# Altium schematic sheet WL-FPGA.SchDoc
size 594 x 420 mm; Address1: Address1; Address2: Address2; Address3: Address3; Address4: Address4; DocumentNumber: Wolf-Lite; SheetNumber: 3; Scale: 1:1; DocumentType: Схема электрическая принципиальная; FirstReferrence: UA3REO/R7KBI
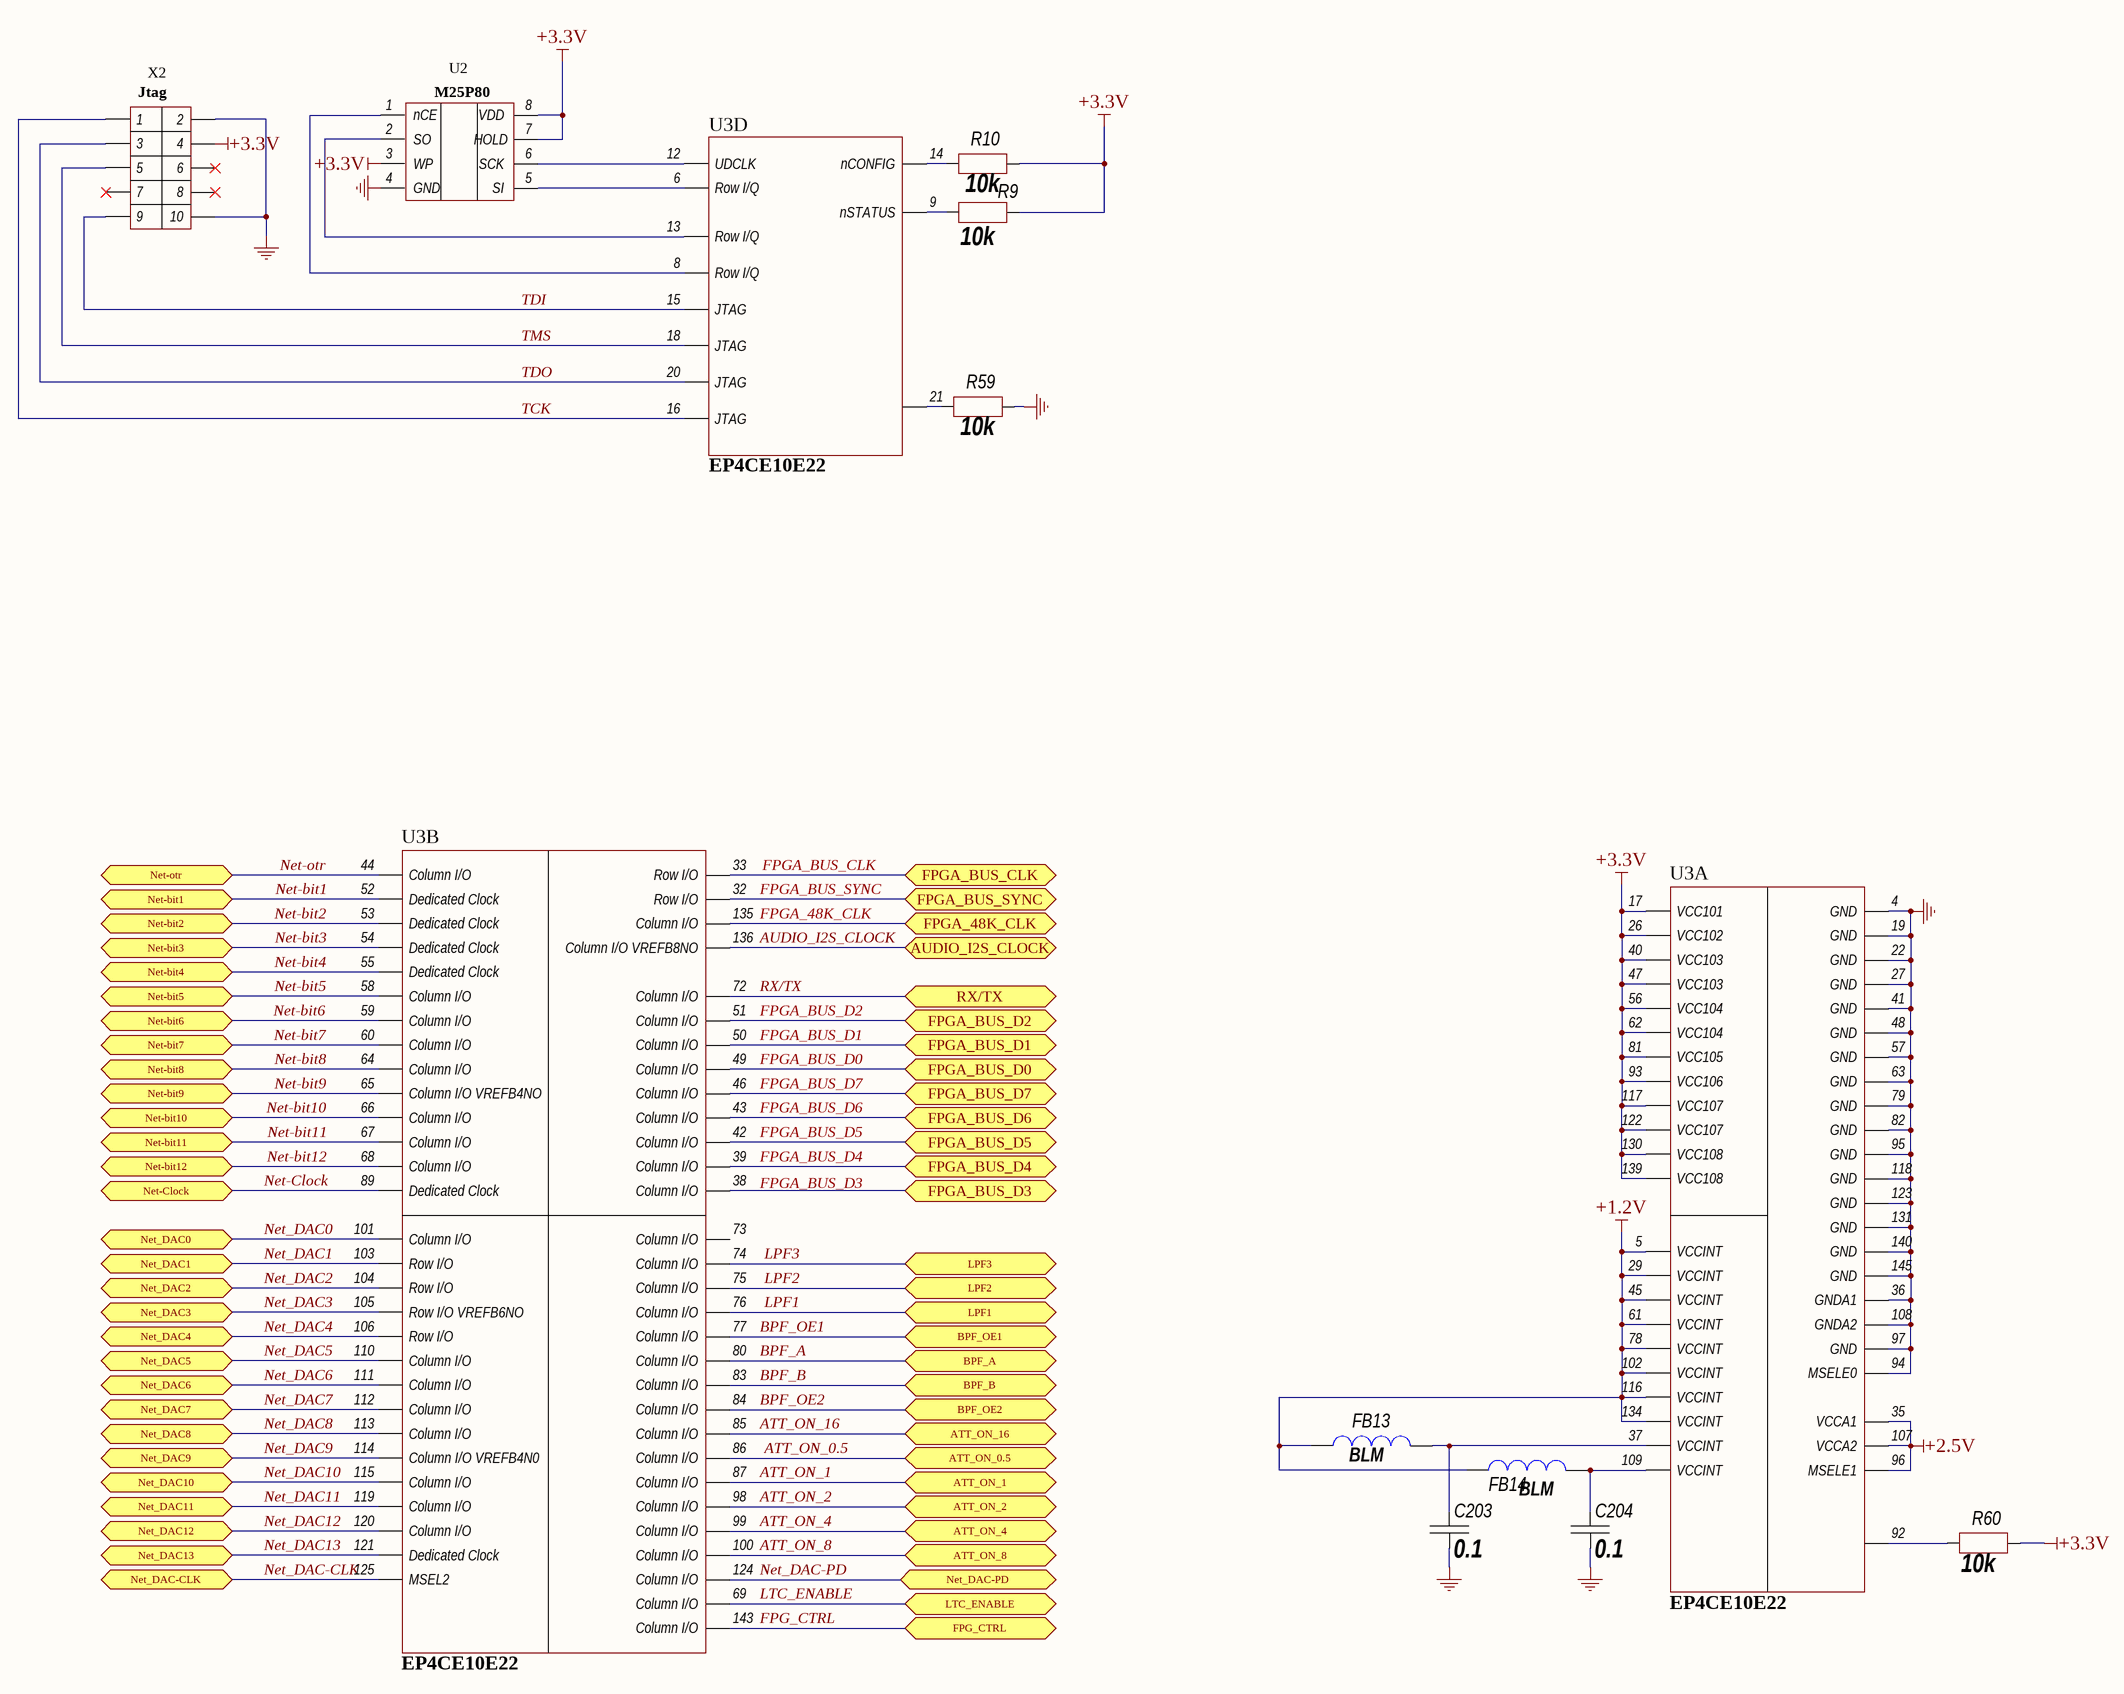
[diagram p0: WL-FPGA.SchDoc]

## Parts
C203  0.1  [CH0805C]
C204  0.1  [CH0805C]
FB13  BLM  [CH0805L]
FB14  BLM  [CH0805L]
R9  10k  [CH0805R]
R10  10k  [CH0805R]
R59  10k  [CH0805R]
R60  10k  [CH0805R]
U2  M25P80  [SOIC-8-1]
U3  EP4CE10E22  [144-QFN]  (parts A,B,D of 4)
X2  Jtag  [CON: BH-10]

## Ports
ATT_ON_0.5 (bidir), ATT_ON_1 (bidir), ATT_ON_2 (bidir), ATT_ON_4 (bidir), ATT_ON_8 (bidir), ATT_ON_16 (bidir), AUDIO_I2S_CLOCK (bidir), BPF_A (bidir), BPF_B (bidir), BPF_OE1 (bidir), BPF_OE2 (bidir), FPG_CTRL (bidir), FPGA_48K_CLK (bidir), FPGA_BUS_CLK (bidir), FPGA_BUS_D0 (bidir), FPGA_BUS_D1 (bidir), FPGA_BUS_D2 (bidir), FPGA_BUS_D3 (bidir), FPGA_BUS_D4 (bidir), FPGA_BUS_D5 (bidir), FPGA_BUS_D6 (bidir), FPGA_BUS_D7 (bidir), FPGA_BUS_SYNC (bidir), LPF1 (bidir), LPF2 (bidir), LPF3 (bidir), LTC_ENABLE (bidir), Net-bit1 (bidir), Net-bit2 (bidir), Net-bit3 (bidir), Net-bit4 (bidir), Net-bit5 (bidir), Net-bit6 (bidir), Net-bit7 (bidir), Net-bit8 (bidir), Net-bit9 (bidir), Net-bit10 (bidir), Net-bit11 (bidir), Net-bit12 (bidir), Net-Clock (bidir), Net-otr (bidir), Net_DAC0 (bidir), Net_DAC1 (bidir), Net_DAC2 (bidir), Net_DAC3 (bidir), Net_DAC4 (bidir), Net_DAC5 (bidir), Net_DAC6 (bidir), Net_DAC7 (bidir), Net_DAC8 (bidir), Net_DAC9 (bidir), Net_DAC10 (bidir), Net_DAC11 (bidir), Net_DAC12 (bidir), Net_DAC13 (bidir), Net_DAC-CLK (bidir), Net_DAC-PD (bidir), RX/TX (bidir)

## Nets
+1.2V: FB13.2 FB14.2 U3.5(VCCINT) U3.29(VCCINT) U3.45(VCCINT) U3.61(VCCINT) U3.78(VCCINT) U3.102(VCCINT) U3.116(VCCINT) U3.134(VCCINT)
+2.5V: U3.35(VCCA1) U3.96(MSELE1) U3.107(VCCA2)
+3.3V: R9.1 R10.1 R60.1 U2.3(WP) U2.7(HOLD) U2.8(VDD) U3.17(VCC101) U3.26(VCC102) U3.40(VCC103) U3.47(VCC103) U3.56(VCC104) U3.62(VCC104) U3.81(VCC105) U3.93(VCC106) U3.117(VCC107) U3.122(VCC107) U3.130(VCC108) U3.139(VCC108) X2.4
GND: C203.1 C204.1 R59.1 U2.4(GND) U3.4(GND) U3.19(GND) U3.22(GND) U3.27(GND) U3.36(GNDA1) U3.41(GND) U3.48(GND) U3.57(GND) U3.63(GND) U3.79(GND) U3.82(GND) U3.94(MSELE0) U3.95(GND) U3.97(GND) U3.108(GNDA2) U3.118(GND) U3.123(GND) U3.131(GND) U3.140(GND) U3.145(GND) X2.2 X2.10
ATT_ON_0.5: U3.86(Column_I/O) ; port ATT_ON_0.5
ATT_ON_1: U3.87(Column_I/O) ; port ATT_ON_1
ATT_ON_2: U3.98(Column_I/O) ; port ATT_ON_2
ATT_ON_4: U3.99(Column_I/O) ; port ATT_ON_4
ATT_ON_8: U3.100(Column_I/O) ; port ATT_ON_8
ATT_ON_16: U3.85(Column_I/O) ; port ATT_ON_16
AUDIO_I2S_CLOCK: U3.136(Column_I/O_VREFB8NO) ; port AUDIO_I2S_CLOCK
BPF_A: U3.80(Column_I/O) ; port BPF_A
BPF_B: U3.83(Column_I/O) ; port BPF_B
BPF_OE1: U3.77(Column_I/O) ; port BPF_OE1
BPF_OE2: U3.84(Column_I/O) ; port BPF_OE2
FPG_CTRL: U3.143(Column_I/O) ; port FPG_CTRL
FPGA_48K_CLK: U3.135(Column_I/O) ; port FPGA_48K_CLK
FPGA_BUS_CLK: U3.33(Row_I/O) ; port FPGA_BUS_CLK
FPGA_BUS_D0: U3.49(Column_I/O) ; port FPGA_BUS_D0
FPGA_BUS_D1: U3.50(Column_I/O) ; port FPGA_BUS_D1
FPGA_BUS_D2: U3.51(Column_I/O) ; port FPGA_BUS_D2
FPGA_BUS_D3: U3.38(Column_I/O) ; port FPGA_BUS_D3
FPGA_BUS_D4: U3.39(Column_I/O) ; port FPGA_BUS_D4
FPGA_BUS_D5: U3.42(Column_I/O) ; port FPGA_BUS_D5
FPGA_BUS_D6: U3.43(Column_I/O) ; port FPGA_BUS_D6
FPGA_BUS_D7: U3.46(Column_I/O) ; port FPGA_BUS_D7
FPGA_BUS_SYNC: U3.32(Row_I/O) ; port FPGA_BUS_SYNC
LPF1: U3.76(Column_I/O) ; port LPF1
LPF2: U3.75(Column_I/O) ; port LPF2
LPF3: U3.74(Column_I/O) ; port LPF3
LTC_ENABLE: U3.69(Column_I/O) ; port LTC_ENABLE
Net-bit1: U3.52(Dedicated_Clock) ; port Net-bit1
Net-bit2: U3.53(Dedicated_Clock) ; port Net-bit2
Net-bit3: U3.54(Dedicated_Clock) ; port Net-bit3
Net-bit4: U3.55(Dedicated_Clock) ; port Net-bit4
Net-bit5: U3.58(Column_I/O) ; port Net-bit5
Net-bit6: U3.59(Column_I/O) ; port Net-bit6
Net-bit7: U3.60(Column_I/O) ; port Net-bit7
Net-bit8: U3.64(Column_I/O) ; port Net-bit8
Net-bit9: U3.65(Column_I/O_VREFB4NO) ; port Net-bit9
Net-bit10: U3.66(Column_I/O) ; port Net-bit10
Net-bit11: U3.67(Column_I/O) ; port Net-bit11
Net-bit12: U3.68(Column_I/O) ; port Net-bit12
Net-Clock: U3.89(Dedicated_Clock) ; port Net-Clock
Net-otr: U3.44(Column_I/O) ; port Net-otr
Net_DAC0: U3.101(Column_I/O) ; port Net_DAC0
Net_DAC1: U3.103(Row_I/O) ; port Net_DAC1
Net_DAC2: U3.104(Row_I/O) ; port Net_DAC2
Net_DAC3: U3.105(Row_I/O_VREFB6NO) ; port Net_DAC3
Net_DAC4: U3.106(Row_I/O) ; port Net_DAC4
Net_DAC5: U3.110(Column_I/O) ; port Net_DAC5
Net_DAC6: U3.111(Column_I/O) ; port Net_DAC6
Net_DAC7: U3.112(Column_I/O) ; port Net_DAC7
Net_DAC8: U3.113(Column_I/O) ; port Net_DAC8
Net_DAC9: U3.114(Column_I/O_VREFB4N0) ; port Net_DAC9
Net_DAC10: U3.115(Column_I/O) ; port Net_DAC10
Net_DAC11: U3.119(Column_I/O) ; port Net_DAC11
Net_DAC12: U3.120(Column_I/O) ; port Net_DAC12
Net_DAC13: U3.121(Dedicated_Clock) ; port Net_DAC13
Net_DAC-CLK: U3.125(MSEL2) ; port Net_DAC-CLK
Net_DAC-PD: U3.124(Column_I/O) ; port Net_DAC-PD
RX/TX: U3.72(Column_I/O) ; port RX/TX
TCK: U3.16(JTAG) X2.1
TDI: U3.15(JTAG) X2.9
TDO: U3.20(JTAG) X2.3
TMS: U3.18(JTAG) X2.5
NetC203_2: C203.2 FB13.1 U3.37(VCCINT)
NetC204_2: C204.2 FB14.1 U3.109(VCCINT)
NetR9_2: R9.2 U3.9(nSTATUS)
NetR10_2: R10.2 U3.14(nCONFIG)
NetR59_2: R59.2 U3.21(nCE)
NetR60_2: R60.2 U3.92
NetU2_1: U2.1(nCE) U3.8(Row_I/Q)
NetU2_2: U2.2(SO) U3.13(Row_I/Q)
NetU2_5: U2.5(SI) U3.6(Row_I/Q)
NetU2_6: U2.6(SCK) U3.12(UDCLK)

Not connected (* = marked no-connect by the designer): U3 73(Column_I/O); X2 6* 7* 8*

## Notes on the sheet
- Labels drawn without touching a wire or pin: FPGA_BUS_D3
- Перв. примен.
- Справ. №
- Подп. и дата
- Инв. № дубл.
- Взам. инв. №
- Инв. № подл.
- Изм.
- Лист
- № докум.
- Подп.
- Дата
- 2.106-A2
- Копировал
- Формат А2

## Library data of the parts
C203 C204 = Capacitor: Manufacturer: *; Model: *; HelpURL: *; ComponentKind: *; Value: *
FB13 FB14 = Inductor: Manufacturer: *; Model: *; HelpURL: *; ComponentKind: *; Value: *
R9 R10 R59 R60 = Resistor: Manufacturer: *; Model: *; HelpURL: *; ComponentKind: *; Value: *
U3 = EP4CE10E22C8N